# EAGLE design tick-mini-mk-1.1 (EAGLE 6.5.0)
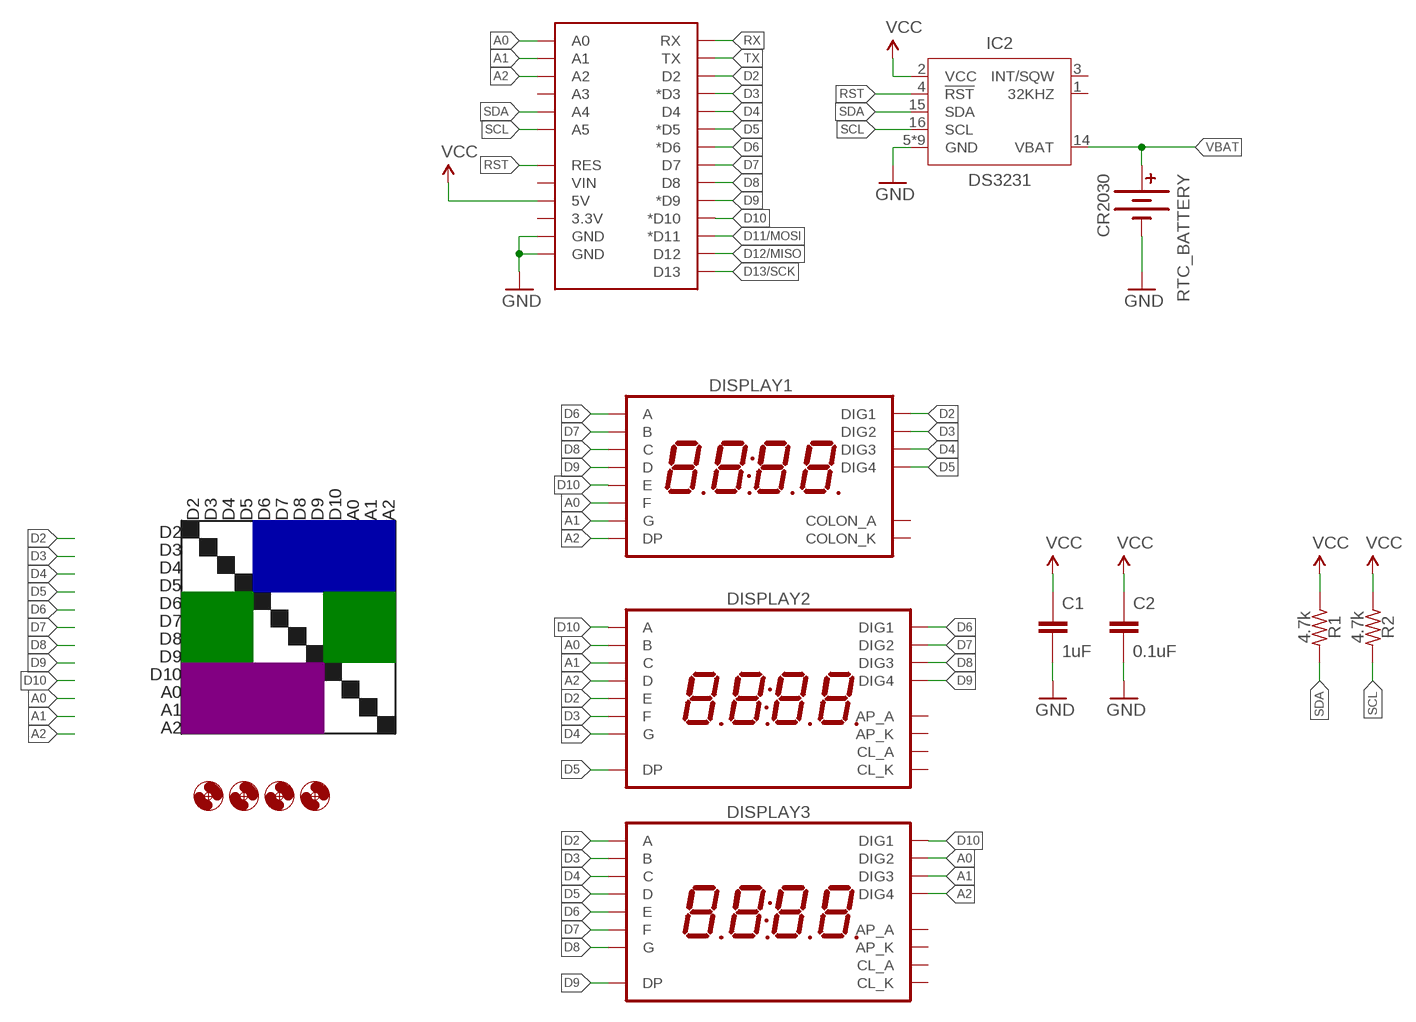
[diagram p0: schematic, sheet 1]

## Parts
C1  1uF  CAPACITOR-CERAMIC025-024X044  [C025-024X044]
C2  0.1uF  CAPACITOR-CERAMIC025-024X044  [C025-024X044]
DISPLAY1  7SEG_4DIGIT_COLON14.2MM-CC-NS  [7SEG_4DIG_NS]
DISPLAY2  7SEG_4DIGIT_COLON_APOS  [7SEG_4DIG_10MM]
DISPLAY3  7SEG_4DIGIT_COLON_APOS  [7SEG_4DIG_10MM]
H1  HOLE#2  [HOLE-#2]
H2  HOLE#2  [HOLE-#2]
H3  HOLE#2  [HOLE-#2]
H4  HOLE#2  [HOLE-#2]
IC2  DS3231  [SO16W]
R1  4.7k  RESISTORPTH-AXIAL-6.35MM  [RESISTOR-AXIAL-PTH-6.35MM]
R2  4.7k  RESISTORPTH-AXIAL-6.35MM  [RESISTOR-AXIAL-PTH-6.35MM]
RTC_BATTERY  CR2030  BATTERY20MMSMD-MINE  [BATTCON_20MM_MINE]
U$1  ARDUINO_SHIELD_SMALLER  [ARDUINO_SHIELD_NOOUTLINE_INSIDE_SMALLER]

## Nets
A0: DISPLAY1.P$12(F) DISPLAY2.16(B) DISPLAY3.2(DIG2) U$1.A0
A1: DISPLAY1.P$5(G) DISPLAY2.13(C) DISPLAY3.6(DIG3) U$1.A1
A2: DISPLAY1.P$3(DP) DISPLAY2.3(D) DISPLAY3.8(DIG4) U$1.A2
D2: DISPLAY1.P$14(DIG1) DISPLAY2.5(E) DISPLAY3.14(A) U$1.D2
D3: DISPLAY1.P$11(DIG2) DISPLAY2.11(F) DISPLAY3.16(B) U$1.D3(*D3)
D4: DISPLAY1.P$10(DIG3) DISPLAY2.15(G) DISPLAY3.13(C) U$1.D4
D5: DISPLAY1.P$6(DIG4) DISPLAY2.7(DP) DISPLAY3.3(D) U$1.D5(*D5)
D6: DISPLAY1.P$13(A) DISPLAY2.1(DIG1) DISPLAY3.5(E) U$1.D6(*D6)
D7: DISPLAY1.P$9(B) DISPLAY2.2(DIG2) DISPLAY3.11(F) U$1.D7
D8: DISPLAY1.P$4(C) DISPLAY2.6(DIG3) DISPLAY3.15(G) U$1.D8
D9: DISPLAY1.P$2(D) DISPLAY2.8(DIG4) DISPLAY3.7(DP) U$1.D9(*D9)
D10: DISPLAY1.P$1(E) DISPLAY2.14(A) DISPLAY3.1(DIG1) U$1.D10(*D10)
D11/MOSI: U$1.D11(*D11)
D12/MISO: U$1.D12
D13/SCK: U$1.D13
GND: C1.2 C2.2 IC2.5(GND) IC2.6(GND) IC2.7(GND) IC2.8(GND) IC2.9(GND) IC2.10(GND) IC2.11(GND) IC2.12(GND) IC2.13(GND) RTC_BATTERY.BOTTOM(-) U$1.GND@0(GND) U$1.GND@1(GND)
RST: IC2.4(!RST) U$1.RES
RX: U$1.RX
SCL: IC2.16(SCL) R2.P$2 U$1.A5
SDA: IC2.15(SDA) R1.P$2 U$1.A4
TX: U$1.TX
VBAT: IC2.14(VBAT) RTC_BATTERY.TOP@1(+) RTC_BATTERY.TOP@2(+)
VCC: C1.1 C2.1 IC2.2(VCC) R1.P$1 R2.P$1 U$1.5V
Unconnected: DISPLAY1.P$7(COLON_K) DISPLAY1.P$8(COLON_A) DISPLAY2.4(CL_A) DISPLAY2.9(AP_K) DISPLAY2.10(AP_A) DISPLAY2.12(CL_K) DISPLAY3.4(CL_A) DISPLAY3.9(AP_K) DISPLAY3.10(AP_A) DISPLAY3.12(CL_K) IC2.1(32KHZ) IC2.3(INT/SQW) U$1.3.3V U$1.A3 U$1.VIN

## Notes on the sheet
- D2 | D3 | D4 | D5 | D6 | D7 | D8 | D9 | D10 | A0 | A1 | A2
- D2
- D3
- D4
- D5
- D6
- D7
- D8
- D9
- D10
- A0
- A1
- A2

## Library data of the parts
C1 C2 = A_butts:CAPACITOR-CERAMIC: CAPACITOR, European symbol
DISPLAY1 = A_butts:7SEG_4DIGIT_COLON
DISPLAY2 DISPLAY3 = A_butts:7SEG_4DIGIT_COLON_APOS
H1-H4 = A_butts:HOLE: MOUNTING HOLE with drill center marker
IC2 = A_butts:DS3231
R1 R2 = A_butts:RESISTOR: RESISTOR, American symbol
RTC_BATTERY = A_butts:BATTERY: Battery Holders Various common sizes : AA, AAA, 20mm coin cell and 12mm coin cell. 20MM_4LEGS, BATT-10373
U$1 = A_butts:ARDUINO_SHIELD_SMALLER

## Board
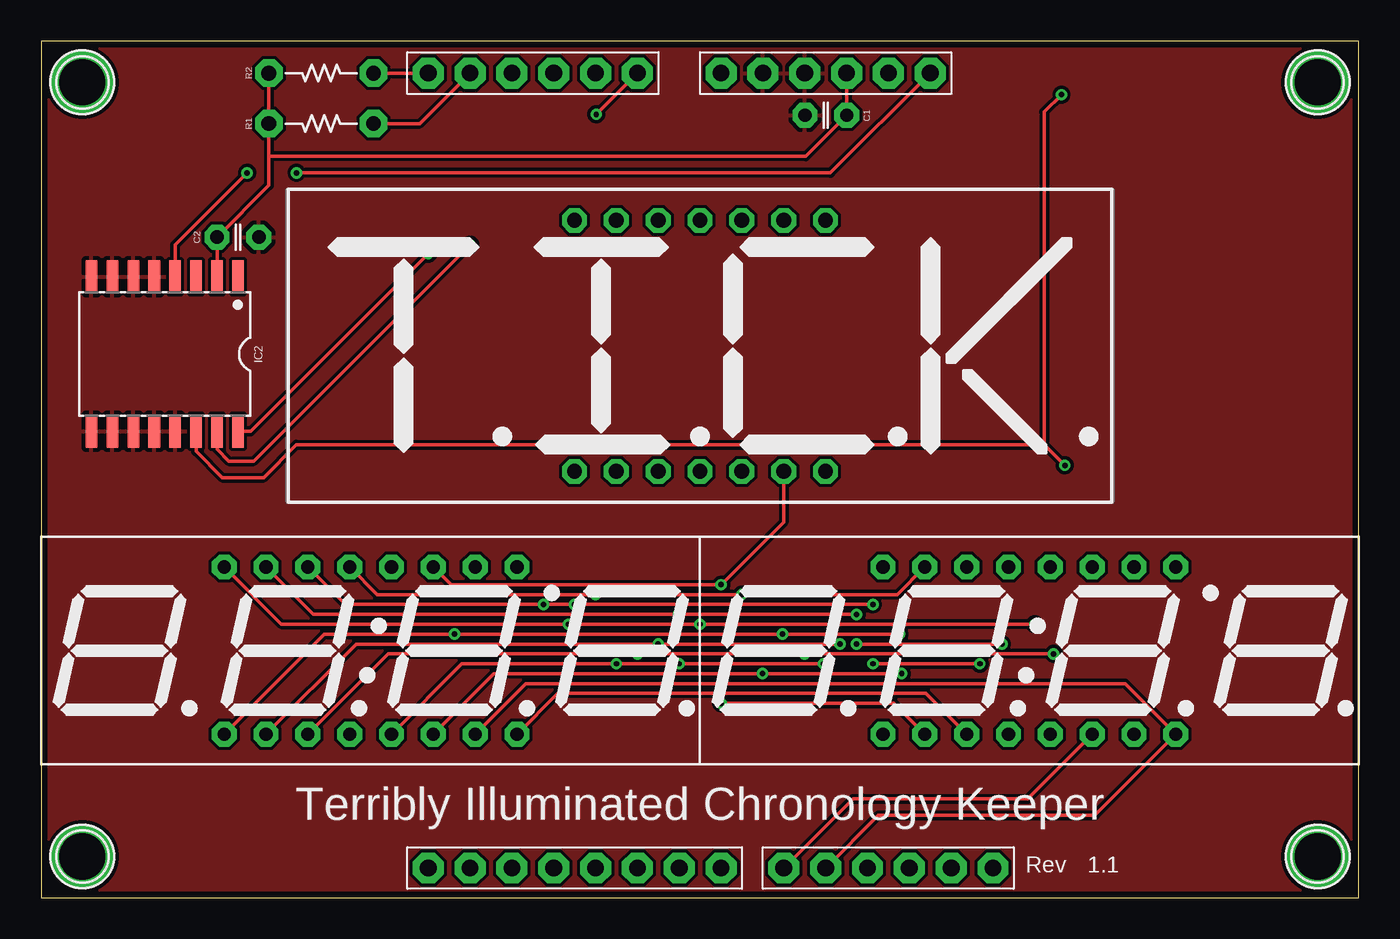
[diagram p1: board, top side]
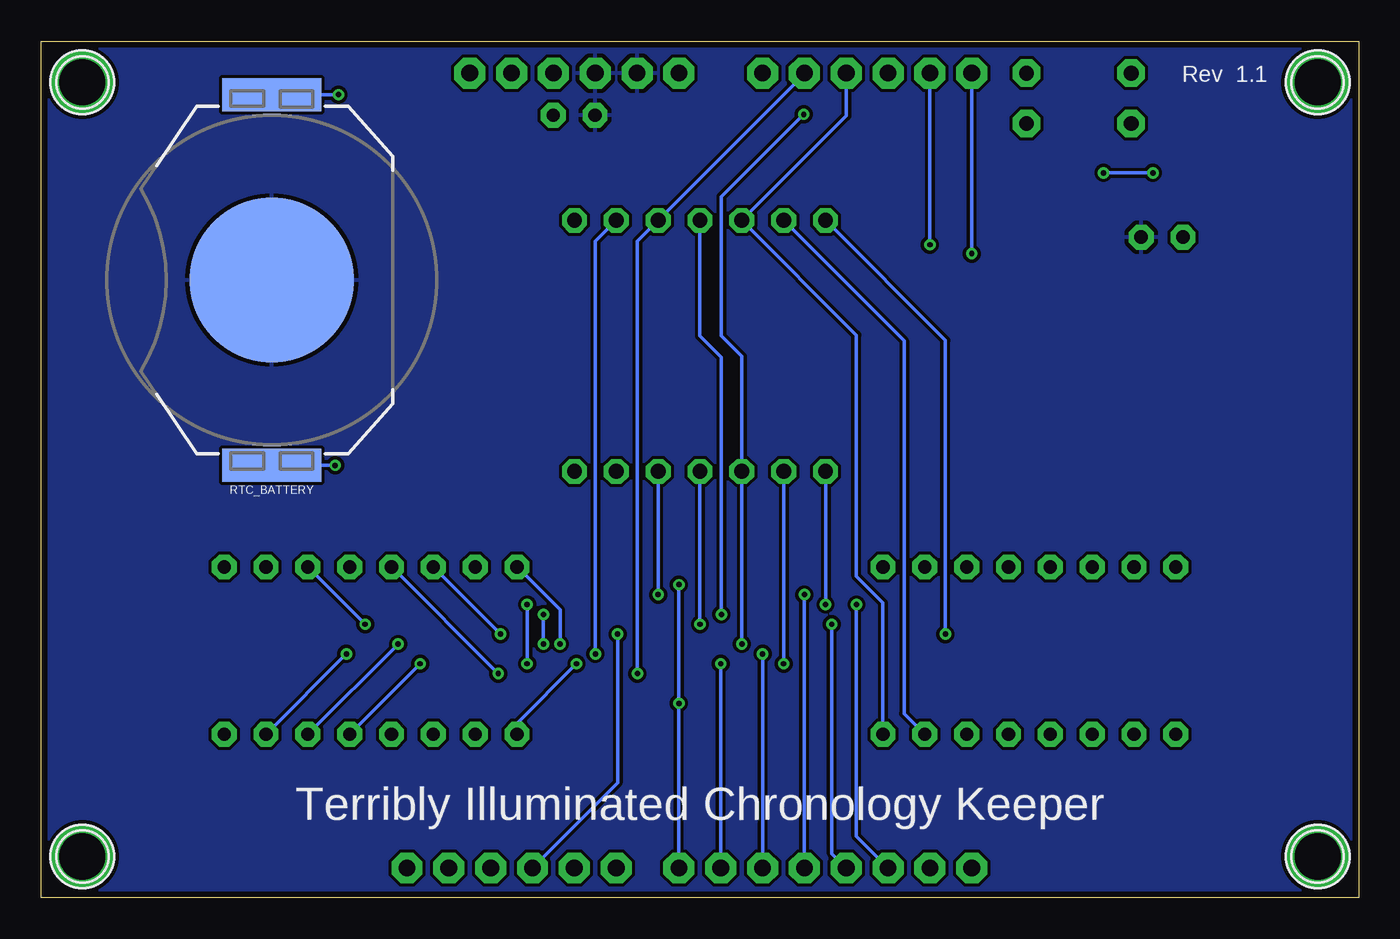
[diagram p2: board, bottom side, seen from below]

Size 80 x 52 mm. Coordinates in mm from the lower left corner, seen from the top.
Outline: 80,0 80,52 0,52 0,0 80,0
Copper layers (1*16): Top 0.0356mm / dielectric 1.5011mm / Bottom 0.0356mm
Design rules "LaenPCBOrder_2": minimum track width 6mil, minimum drill 13mil, track to track 6mil, track to pad 6mil, pad to pad 6mil, via to via 6mil, smd to smd 6mil, copper to edge 15mil, drill to drill 6mil, minimum pad ring 7mil, minimum via ring 7mil, stop-mask expansion 3mil, vias tented up to drill 20mil, thermal gap 10mil

### Footprints (pad centres in the part's own frame; a part is rotated, then mirrored left to right if it is on the bottom)
C025-024X044 = drill 0.813 pad 1.5 octagon: 1 -1.27,0; 2 1.27,0
7SEG_4DIG_NS = drill 0.9 pad 1.5 octagon: P$1 -7.62,7.62; P$2 -5.08,7.62; P$3 -2.54,7.62; P$4 0,7.62; P$5 2.54,7.62; P$6 5.08,7.62; P$7 7.62,7.62; P$8 7.62,-7.62; P$9 5.08,-7.62; P$10 2.54,-7.62; P$11 0,-7.62; P$12 -2.54,-7.62; P$13 -5.08,-7.62; P$14 -7.62,-7.62
7SEG_4DIG_10MM = drill 0.8 pad 1.5 octagon: 1 -8.89,-5.08; 2 -6.35,-5.08; 3 -3.81,-5.08; 4 -1.27,-5.08; 5 1.27,-5.08; 6 3.81,-5.08; 7 6.35,-5.08; 8 8.89,-5.08; 9 8.89,5.08; 10 6.35,5.08; 11 3.81,5.08; 12 1.27,5.08; 13 -1.27,5.08; 14 -3.81,5.08; 15 -6.35,5.08; 16 -8.89,5.08
HOLE-#2 = drill 2.8 pad 3.81: P$1 0,0
SO16W = smd 0.7 x 2: 1 -4.445,-4.685; 2 -3.175,-4.685; 3 -1.905,-4.685; 4 -0.635,-4.685; 5 0.635,-4.685; 6 1.905,-4.685; 7 3.175,-4.685; 8 4.445,-4.685; 9 4.445,4.685; 10 3.175,4.685; 11 1.905,4.685; 12 0.635,4.685; 13 -0.635,4.685; 14 -1.905,4.685; 15 -3.175,4.685; 16 -4.445,4.685
RESISTOR-AXIAL-PTH-6.35MM = drill 0.9 pad 1.676 octagon: P$1 -3.175,0; P$2 3.175,0
BATTCON_20MM_MINE = smd 10 x 10: BOTTOM 0,0 | smd 6 x 2: TOP@1 0,11.25; TOP@2 0,-11.25
ARDUINO_SHIELD_NOOUTLINE_INSIDE_SMALLER = drill 1.016 pad 1.88 octagon: 3.3V 48.26,-27.94; 5V 48.26,-25.4; A0 48.26,-12.7; A1 48.26,-10.16; A2 48.26,-7.62; A3 48.26,-5.08; A4 48.26,-2.54; A5 48.26,0; D2 0,-5.08; D3 0,-7.62; D4 0,-10.16; D5 0,-12.7; D6 0,-15.24; D7 0,-17.78; D8 0,-21.59; D9 0,-24.13; D10 0,-26.67; D11 0,-29.21; D12 0,-31.75; D13 0,-34.29; GND@0 48.26,-22.86; GND@1 48.26,-20.32; RES 48.26,-30.48; RX 0,0; TX 0,-2.54; VIN 48.26,-17.78

### Placement (x,y rotation side)
C1  47.64,47.5 180 top
C2  11.95,40.1 0 top
DISPLAY1  40,33.5 0 top
DISPLAY2  60,15 0 top
DISPLAY3  20,15 0 top
H1  2.5,2.5 0 top
H2  77.5,2.5 0 top
H3  77.5,49.5 0 top
H4  2.5,49.5 0 top
IC2  7.5,33 180 top
R1  17,47 0 top
R2  17,50.06 0 top
RTC_BATTERY  66,37.5 180 bottom
U$1  23.5,1.8 90 top
U$2  [TICK_SYMBOL_0.56]  40,33.5 0 top

### Tracks (layer width: path | path; a pad name or v marks a point on that pad's centre or on a via)
A0  (via drill 0.33)
  Top 0.2: DISPLAY3.2 19.13,15.4 v37.46,15.4 v48.5,15.4 | U$1.A0 v33.7,47.56
  Bottom 0.2: v37.46,15.4 DISPLAY1.P$12 37.46,32.86 38.7,34.1 38.7,42.56 v33.7,47.56 | v48.5,15.4 48.5,17.47 DISPLAY2.16
A1  (via drill 0.33)
  Top 0.2: DISPLAY3.6 27.49,13.6 v43.8,13.6 v52.25,13.6
  Bottom 0.2: U$1.A1 33.66,50 DISPLAY1.P$5 43.8,39.86 v43.8,13.6 | v52.25,13.6 DISPLAY2.13
A2
  Top 0.2: DISPLAY3.8 31.37,12.4 53.71,12.4 DISPLAY2.3
  Bottom 0.2: U$1.A2 31.12,47.46 DISPLAY1.P$3 30.5,34.16 30.5,19.5 28.89,17.89 DISPLAY3.8
D2  (via drill 0.33)
  Top 0.2: DISPLAY3.14 18.47,17.8 v30.5,17.8 v32.38,17.8 v50.5,17.8 | v50.5,14.2 v56.99,14.2
  Bottom 0.2: U$1.D2 30.5,3.72 v30.5,17.8 | v50.5,17.8 v50.5,14.2 | v56.99,14.2 DISPLAY2.5 | DISPLAY1.P$14 v32.38,17.8
D3  (via drill 0.33)
  Top 0.2: DISPLAY3.16 14.59,16.6 v32,16.6 v40,16.6 v60.33,16.6
  Bottom 0.2: U$1.D3 32,2.68 v32,16.6 | v60.33,16.6 DISPLAY2.11 | DISPLAY1.P$11 v40,16.6
D4  (via drill 0.33)
  Top 0.2: DISPLAY3.13 20.41,18.4 v33.66,18.4 v42.54,18.4 51.97,18.4 DISPLAY2.15
  Bottom 0.2: U$1.D4 v33.66,18.4 | v42.54,18.4 DISPLAY1.P$10
D5  (via drill 0.33)
  Top 0.2: DISPLAY3.3 21.07,14.8 v36.2,14.8 v46.35,14.8 v61.47,14.8
  Bottom 0.2: U$1.D5 v36.2,14.8 | v61.47,14.8 DISPLAY2.7 | DISPLAY1.P$6 46.35,39.85 v46.35,14.8
D6  (via drill 0.33)
  Top 0.2: DISPLAY3.5 25.55,14.2 v34.92,14.2 v38.74,14.2 v47.5,14.2
  Bottom 0.2: U$1.D6 v38.74,14.2 | DISPLAY1.P$13 v34.92,14.2 | v47.5,14.2 51.11,10.59 DISPLAY2.1
D7  (via drill 0.33)
  Top 0.2: DISPLAY3.11 24.89,19 v41.28,19 45.08,22.8 DISPLAY1.P$9 | v41.28,11.8 51.77,11.8 DISPLAY2.2
  Bottom 0.2: U$1.D7 v41.28,11.8 v41.28,19
D8  (via drill 0.33)
  Top 0.2: DISPLAY3.15 16.53,17.2 v38.7,17.2 v49.51,17.2 | v49.51,15.4 v58.33,15.4 | U$1.D8 49.29,6 59.89,6 DISPLAY2.6
  Bottom 0.2: v49.51,17.2 v49.51,15.4 | v58.33,15.4 DISPLAY2.6 | DISPLAY1.P$4 40,34.1 38.7,32.8 v38.7,17.2
D9
  Top 0.2: DISPLAY3.7 29.43,13 65.81,13 DISPLAY2.8 63.97,5 50.83,5 U$1.D9
  Bottom 0.2: DISPLAY1.P$2 27.6,33.8 27.6,11.17 DISPLAY3.7
D10  (via drill 0.33)
  Top 0.2: DISPLAY3.1 17.19,16 v25.1,16 v45,16 v52.11,16
  Bottom 0.2: v52.11,16 DISPLAY2.14 | v25.1,16 25.1,33.84 DISPLAY1.P$1 | v45,16 45,6.97 U$1.D10
GND
  pour Top (isolate 0.2): 0,52 80,52 80,0 0,0
  pour Bottom (isolate 0.2): 0,52 80,52 80,0 0,0
RST  (via drill 0.33)
  Top 0.2: v15.5,44 47.92,44 U$1.RES | IC2.4 8.13,39.63 v12.5,44
  Bottom 0.2: v15.5,44 v12.5,44
SCL  (via drill 0.33)
  Top 0.2: v23.5,39.1 12.71,28.32 IC2.16 | R2.P$2 U$1.A5
  Bottom 0.2: v23.5,39.1 U$1.A5
SDA  (via drill 0.33)
  Top 0.2: IC2.15 10.68,27.23 11.4,26.5 12.9,26.5 v26.04,39.64 | R1.P$2 22.98,47 U$1.A4
  Bottom 0.2: U$1.A4 v26.04,39.64
VBAT  (via drill 0.33)
  Top 0.2: IC2.14 9.4,27.09 11,25.5 13.5,25.5 15.5,27.5 60.9,27.5 | v62.15,26.25 60.9,27.5 | v61.95,48.75 60.9,47.7 60.9,27.5
  Bottom 0.2: v62.15,26.25 RTC_BATTERY.TOP@1 | RTC_BATTERY.TOP@2 v61.95,48.75
VCC
  Top 0.2: IC2.2 C2.1 13.82,43.25 13.82,45 | 13.82,45 R1.P$1 R2.P$1 | 13.82,45 46.41,45 C1.1 U$1.5V

### Text on the board
tPlace: Terribly Illuminated Chronology Keeper | Rev
bPlace: Rev | Terribly Illuminated Chronology Keeper